# EAGLE design 0234-carrier-level-shifter-x8 (EAGLE 9.6.2)
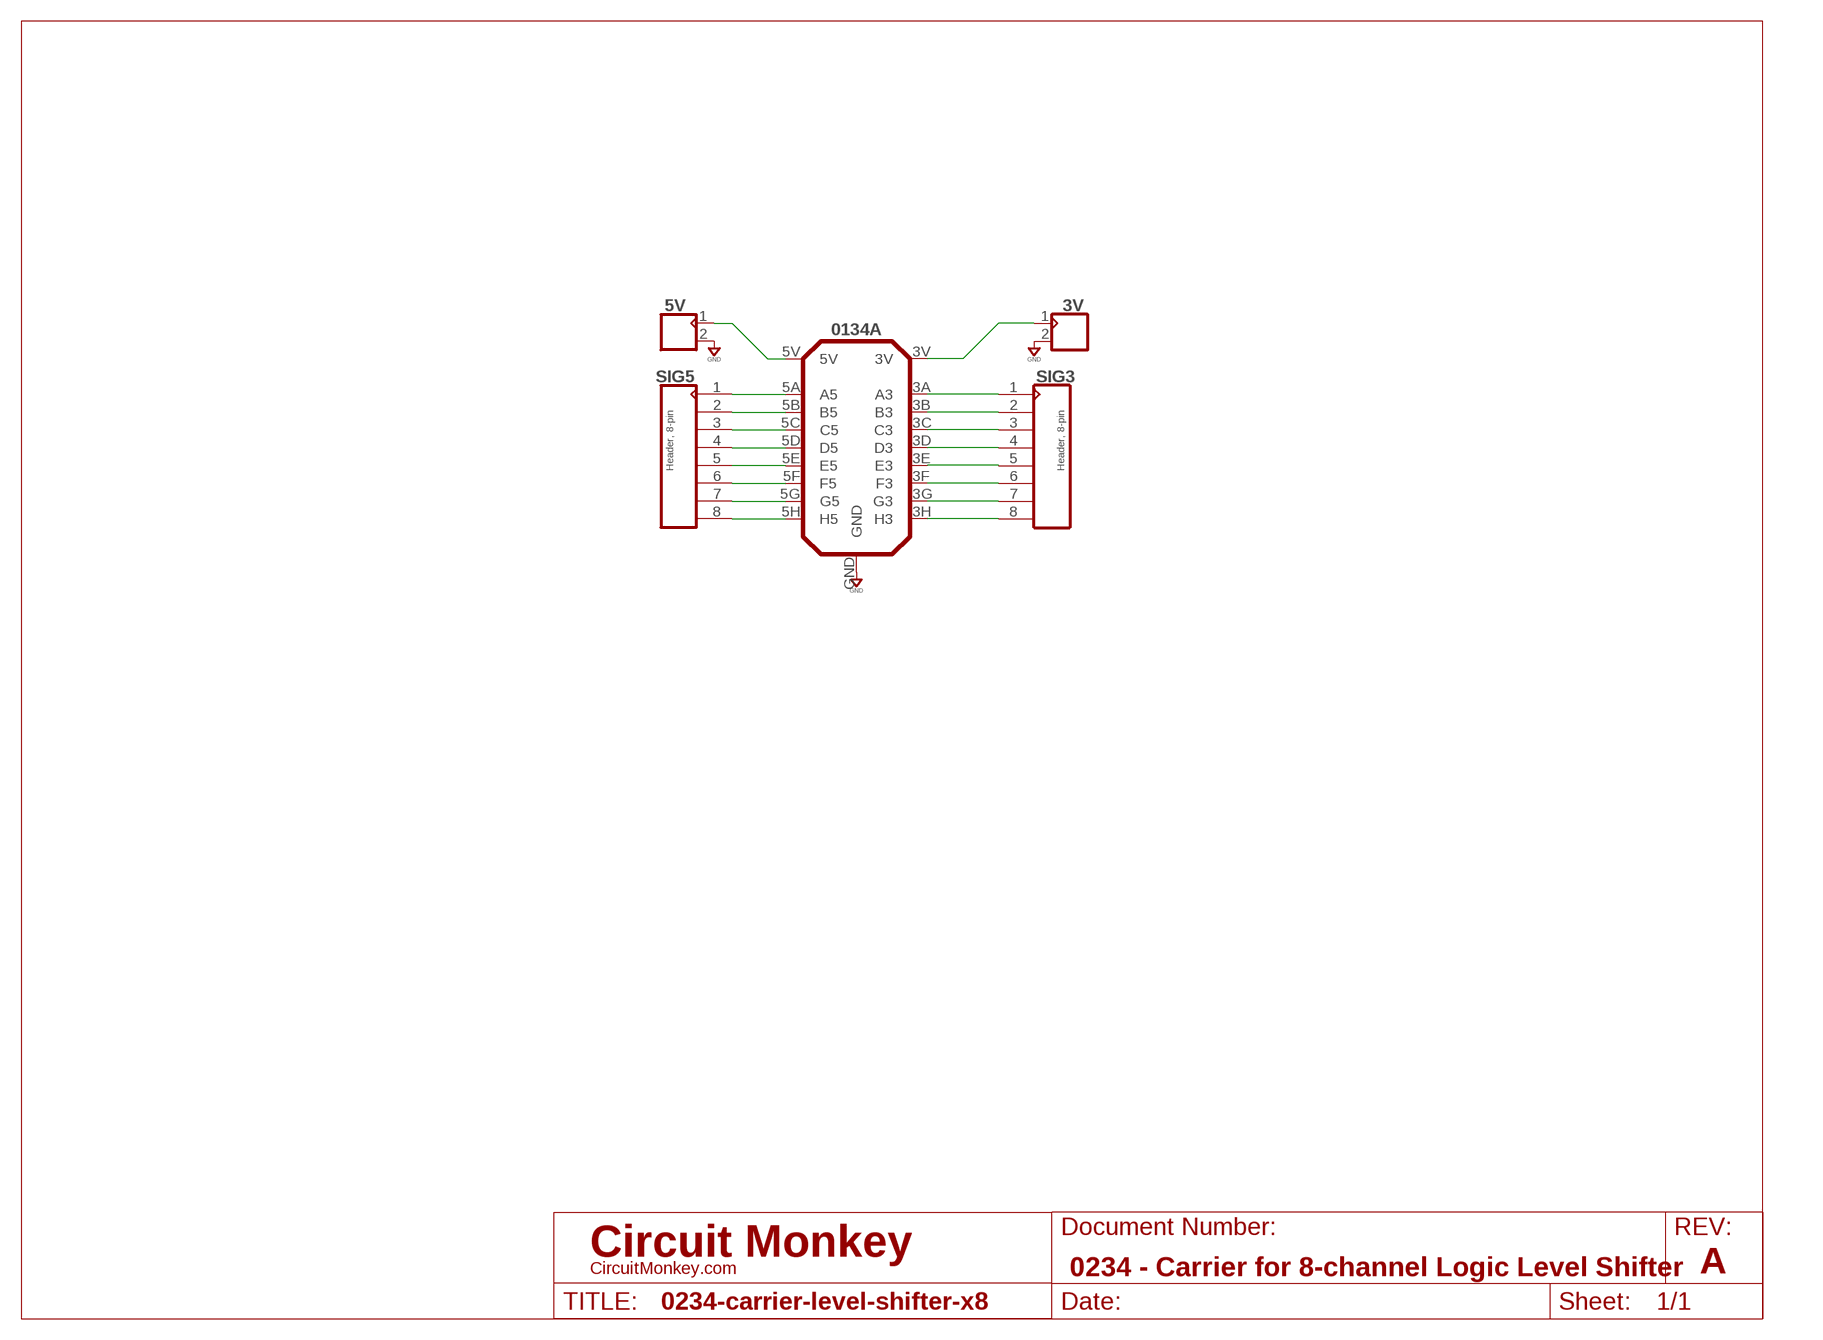
[diagram p0: schematic, sheet 1]
SHEET1 (LETTER_L-CIRCUITMONKEY): DOCUMENT_NUMBER: 0234 - Carrier for 8-channel Logic Level Shifter; REV: A

## Parts
3V  CON_02X1-2.54MM-THD-VT  [MA02X1-VT-THD]
5V  CON_02X1-2.54MM-THD-VT  [MA02X1-VT-THD]
0134A  0134REV_A  [0134A]
SIG3  Header, 8-pin  CON_08X1-VT-THD  [MA08X1-VT-THD]
SIG5  Header, 8-pin  CON_08X1-VT-THD  [MA08X1-VT-THD]

## Nets
GND: 3V.2 5V.2 0134A.GND
N$1: 5V.1 0134A.5V
N$2: 3V.1 0134A.3V
N$3: 0134A.5F(F5) SIG5.6
N$4: 0134A.5E(E5) SIG5.5
N$5: 0134A.5D(D5) SIG5.4
N$6: 0134A.5C(C5) SIG5.3
N$7: 0134A.5B(B5) SIG5.2
N$8: 0134A.5A(A5) SIG5.1
N$9: 0134A.5G(G5) SIG5.7
N$10: 0134A.5H(H5) SIG5.8
N$11: 0134A.3F(F3) SIG3.6
N$12: 0134A.3E(E3) SIG3.5
N$13: 0134A.3D(D3) SIG3.4
N$14: 0134A.3C(C3) SIG3.3
N$15: 0134A.3B(B3) SIG3.2
N$16: 0134A.3A(A3) SIG3.1
N$17: 0134A.3G(G3) SIG3.7
N$18: 0134A.3H(H3) SIG3.8

## Library data of the parts
3V 5V = con-headers:CON_02X1: Connector, 2P
0134A = circuit-monkey-chips:0134: Logic Level Shifter - 8-channel
SIG3 SIG5 = con-headers:CON_08X1: Header, 8-pin, 1-row, 2.54mm; COST01: 0.14

## Board
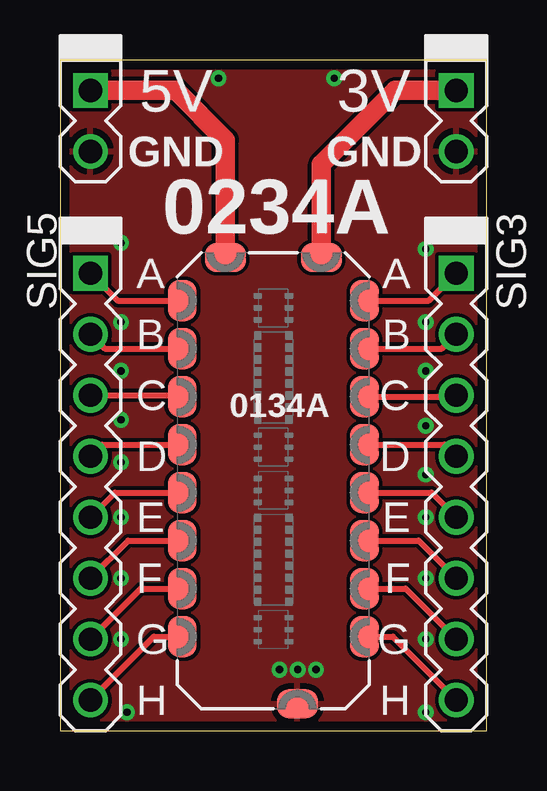
[diagram p1: board, top side]
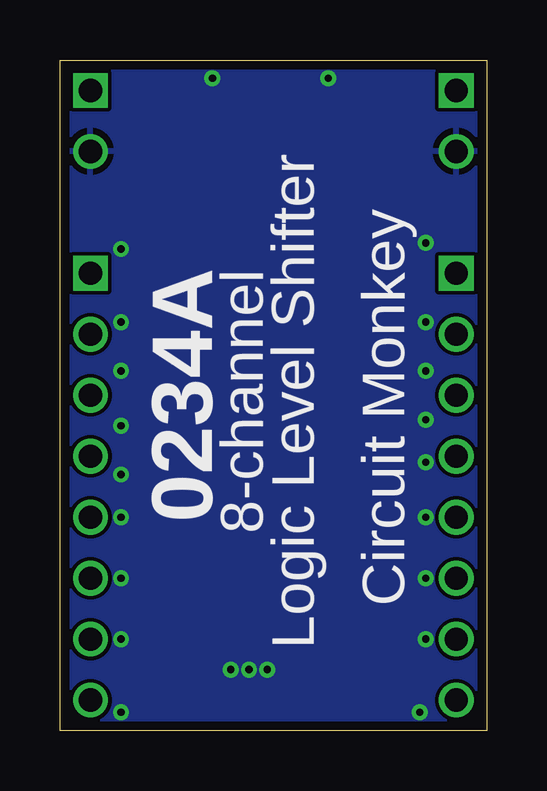
[diagram p2: board, bottom side, seen from below]

Size 17.78 x 27.94 mm. Coordinates in mm from the lower left corner, seen from the top.
Outline: 0,0 17.78,0 17.78,27.94 0,27.94 0,0
Copper layers (1*16): Top 0.0356mm / dielectric 1.5011mm / Bottom 0.0356mm
Design rules "OSH-CircuitMonkey": minimum track width 6mil, minimum drill 12mil, track to track 6mil, track to pad 6mil, pad to pad 6mil, via to via 6mil, smd to smd 6mil, copper to edge 15mil, drill to drill 6mil, minimum pad ring 7mil, minimum via ring 7mil, stop-mask expansion 3mil, vias tented up to drill 13mil, thermal gap 10mil

### Footprints (pad centres in the part's own frame; a part is rotated, then mirrored left to right if it is on the bottom)
MA02X1-VT-THD = drill 0.965 square: 1 -1.27,0 | drill 0.965: 2 1.27,0
0134A = smd 1.2 x 1.7: 3A 3.8,7.5; 3B 3.8,5.5; 3C 3.8,3.5; 3D 3.8,1.5; 3E 3.8,-0.5; 3F 3.8,-2.5; 3G 3.8,-4.5; 3H 3.8,-6.5; 5A -3.8,7.5; 5B -3.8,5.5; 5C -3.8,3.5; 5D -3.8,1.5; 5E -3.8,-0.5; 5F -3.8,-2.5; 5G -3.8,-4.5; 5H -3.8,-6.5 | smd 1.7 x 1.2: 3V 2,9.3; 5V -2,9.3; GND 1,-9.3
MA08X1-VT-THD = drill 0.965 square: 1 -8.89,0 | drill 0.965: 2 -6.35,0; 3 -3.81,0; 4 -1.27,0; 5 1.27,0; 6 3.81,0; 7 6.35,0; 8 8.89,0

### Placement (x,y rotation side)
3V  16.51,25.4 270 top
5V  1.27,25.4 270 top
0134A  8.89,10.41 0 top
SIG3  16.51,10.16 270 top
SIG5  1.27,10.16 270 top

### Tracks (layer width: path | path; a pad name or v marks a point on that pad's centre or on a via)
GND  (via drill 0.3)
  other vias: 9.91,2.54 2.54,3.81 2.54,6.35 2.54,8.89 2.54,11.18 2.54,12.95 2.54,14.99 2.54,17.02 15.24,17.02 15.24,14.99 15.24,12.7 15.24,10.67 15.24,8.89 15.24,6.35 15.24,3.81 15.24,0.76 2.79,0.76 9.14,2.54 10.67,2.54 11.43,27.18 6.6,27.18 15.24,20.07 2.54,20.32
  pour Bottom: 0,0 17.78,0 17.78,27.94 0,27.94
  pour Top: 17.78,0 0,0 0,27.94 17.78,27.94
N$1
  Top 0.813: 0134A.5V 6.89,24.61 4.83,26.67 5V.1
N$2
  Top 0.813: 0134A.3V 10.89,23.59 13.97,26.67 3V.1
N$3
  Top 0.254: SIG5.6 2.83,7.91 0134A.5F
N$4
  Top 0.254: SIG5.5 2.29,9.91 0134A.5E
N$5
  Top 0.254: SIG5.4 1.75,11.91 0134A.5D
N$6
  Top 0.254: SIG5.3 5.03,13.97 0134A.5C
N$7
  Top 0.254: SIG5.2 1.87,15.91 0134A.5B
N$8
  Top 0.254: SIG5.1 2.41,17.91 0134A.5A
N$9
  Top 0.254: SIG5.7 3.37,5.91 0134A.5G
N$10
  Top 0.254: SIG5.8 3.91,3.91 0134A.5H
N$11
  Top 0.254: 0134A.3F 14.95,7.91 SIG3.6
N$12
  Top 0.254: 0134A.3E 15.49,9.91 SIG3.5
N$13
  Top 0.254: 0134A.3D 16.03,11.91 SIG3.4
N$14
  Top 0.254: 0134A.3C 16.45,13.91 SIG3.3
N$15
  Top 0.254: 0134A.3B 15.91,15.91 SIG3.2
N$16
  Top 0.254: 0134A.3A 15.37,17.91 SIG3.1
N$17
  Top 0.254: 0134A.3G 14.41,5.91 SIG3.7
N$18
  Top 0.254: 0134A.3H 13.87,3.91 SIG3.8

### Text on the board
tPlace: GND | GND | 0234A | A | A | B | B | C | C | D | D | E | E | F | F | G | G | H | H
bPlace: 8-channel / Logic Level Shifter | 0234A | Circuit Monkey